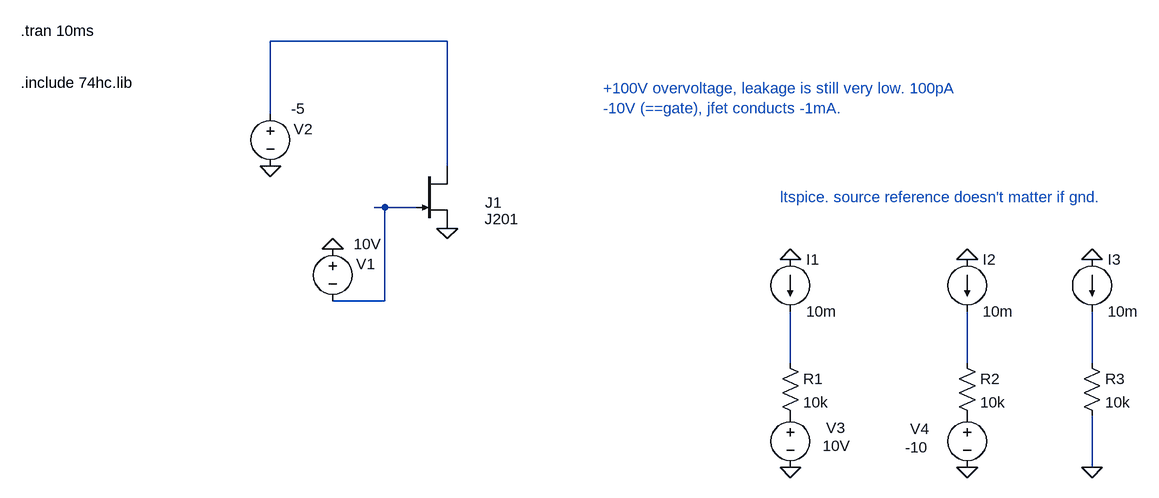
[diagram p0: schematic Draft61.asc]
Draft61.asc, the LTspice schematic file:
Version 4
SHEET 1 2756 1020
WIRE -16 -176 -288 -176
WIRE -288 -64 -288 -176
WIRE -16 16 -16 -176
WIRE -112 80 -128 80
WIRE -64 80 -112 80
WIRE -112 224 -112 80
WIRE -112 224 -192 224
WIRE 512 320 512 240
WIRE 784 320 784 240
WIRE 976 320 976 240
WIRE 976 480 976 400
FLAG -288 16 0
FLAG -16 112 0
FLAG -192 144 0
FLAG 512 160 0
FLAG 512 480 0
FLAG 784 160 0
FLAG 784 480 0
FLAG 976 160 0
FLAG 976 480 0
SYMBOL njf -64 16 R0
WINDOW 0 132 56 Right 2
WINDOW 3 158 82 Right 2
SYMATTR InstName J1
SYMATTR Value J201
SYMBOL voltage -288 -80 R0
WINDOW 123 0 0 Left 0
WINDOW 39 0 0 Left 0
WINDOW 0 36 39 Left 2
WINDOW 3 32 8 Left 2
SYMATTR InstName V2
SYMATTR Value -5
SYMBOL voltage -192 128 R0
WINDOW 123 0 0 Left 0
WINDOW 39 0 0 Left 0
WINDOW 0 36 39 Left 2
WINDOW 3 32 8 Left 2
SYMATTR InstName V1
SYMATTR Value 10V
SYMBOL current 512 160 R0
WINDOW 123 0 0 Left 0
WINDOW 39 0 0 Left 0
SYMATTR InstName I1
SYMATTR Value 10m
SYMBOL res 496 304 R0
SYMATTR InstName R1
SYMATTR Value 10k
SYMBOL voltage 512 384 R0
WINDOW 123 0 0 Left 0
WINDOW 39 0 0 Left 0
WINDOW 0 55 35 Left 2
WINDOW 3 50 63 Left 2
SYMATTR InstName V3
SYMATTR Value 10V
SYMBOL current 784 160 R0
WINDOW 123 0 0 Left 0
WINDOW 39 0 0 Left 0
SYMATTR InstName I2
SYMATTR Value 10m
SYMBOL res 768 304 R0
SYMATTR InstName R2
SYMATTR Value 10k
SYMBOL voltage 784 384 R0
WINDOW 123 0 0 Left 0
WINDOW 39 0 0 Left 0
WINDOW 0 -88 37 Left 2
WINDOW 3 -95 65 Left 2
SYMATTR InstName V4
SYMATTR Value -10
SYMBOL current 976 160 R0
WINDOW 123 0 0 Left 0
WINDOW 39 0 0 Left 0
SYMATTR InstName I3
SYMATTR Value 10m
SYMBOL res 960 304 R0
SYMATTR InstName R3
SYMATTR Value 10k
TEXT -672 -192 Left 2 !.tran 10ms
TEXT -672 -112 Left 2 !.include 74hc.lib
TEXT 224 -104 Left 2 ;+100V overvoltage, leakage is still very low. 100pA\n-10V (==gate), jfet conducts -1mA.
TEXT 496 64 Left 2 ;ltspice. source reference doesn't matter if gnd.

The netlist it stands for:
* Draft61.asc
J1 N001 N002 0 J201
V2 N001 0 -5
V1 0 N002 10V
I1 0 N003 10m
R1 N003 P001 10k
V3 P001 0 10V
I2 0 N004 10m
R2 N004 P002 10k
V4 P002 0 -10
I3 0 N005 10m
R3 N005 0 10k
.model NJF NJF
.model PJF PJF
.lib standard.jft
.tran 10ms
.include 74hc.lib
* +100V overvoltage, leakage is still very low. 100pA
* -10V (==gate), jfet conducts -1mA.
* ltspice. source reference doesn't matter if gnd.
.backanno
.end